# EasyEDA schematic ULN2003 Motor Driver_2021-05-13.json
TITLE: Sheet_1; REV: 1.0; Date: 2021-05-13; Sheet: 1/1; Drawn By: Sreeram AJ; Company: Your Company
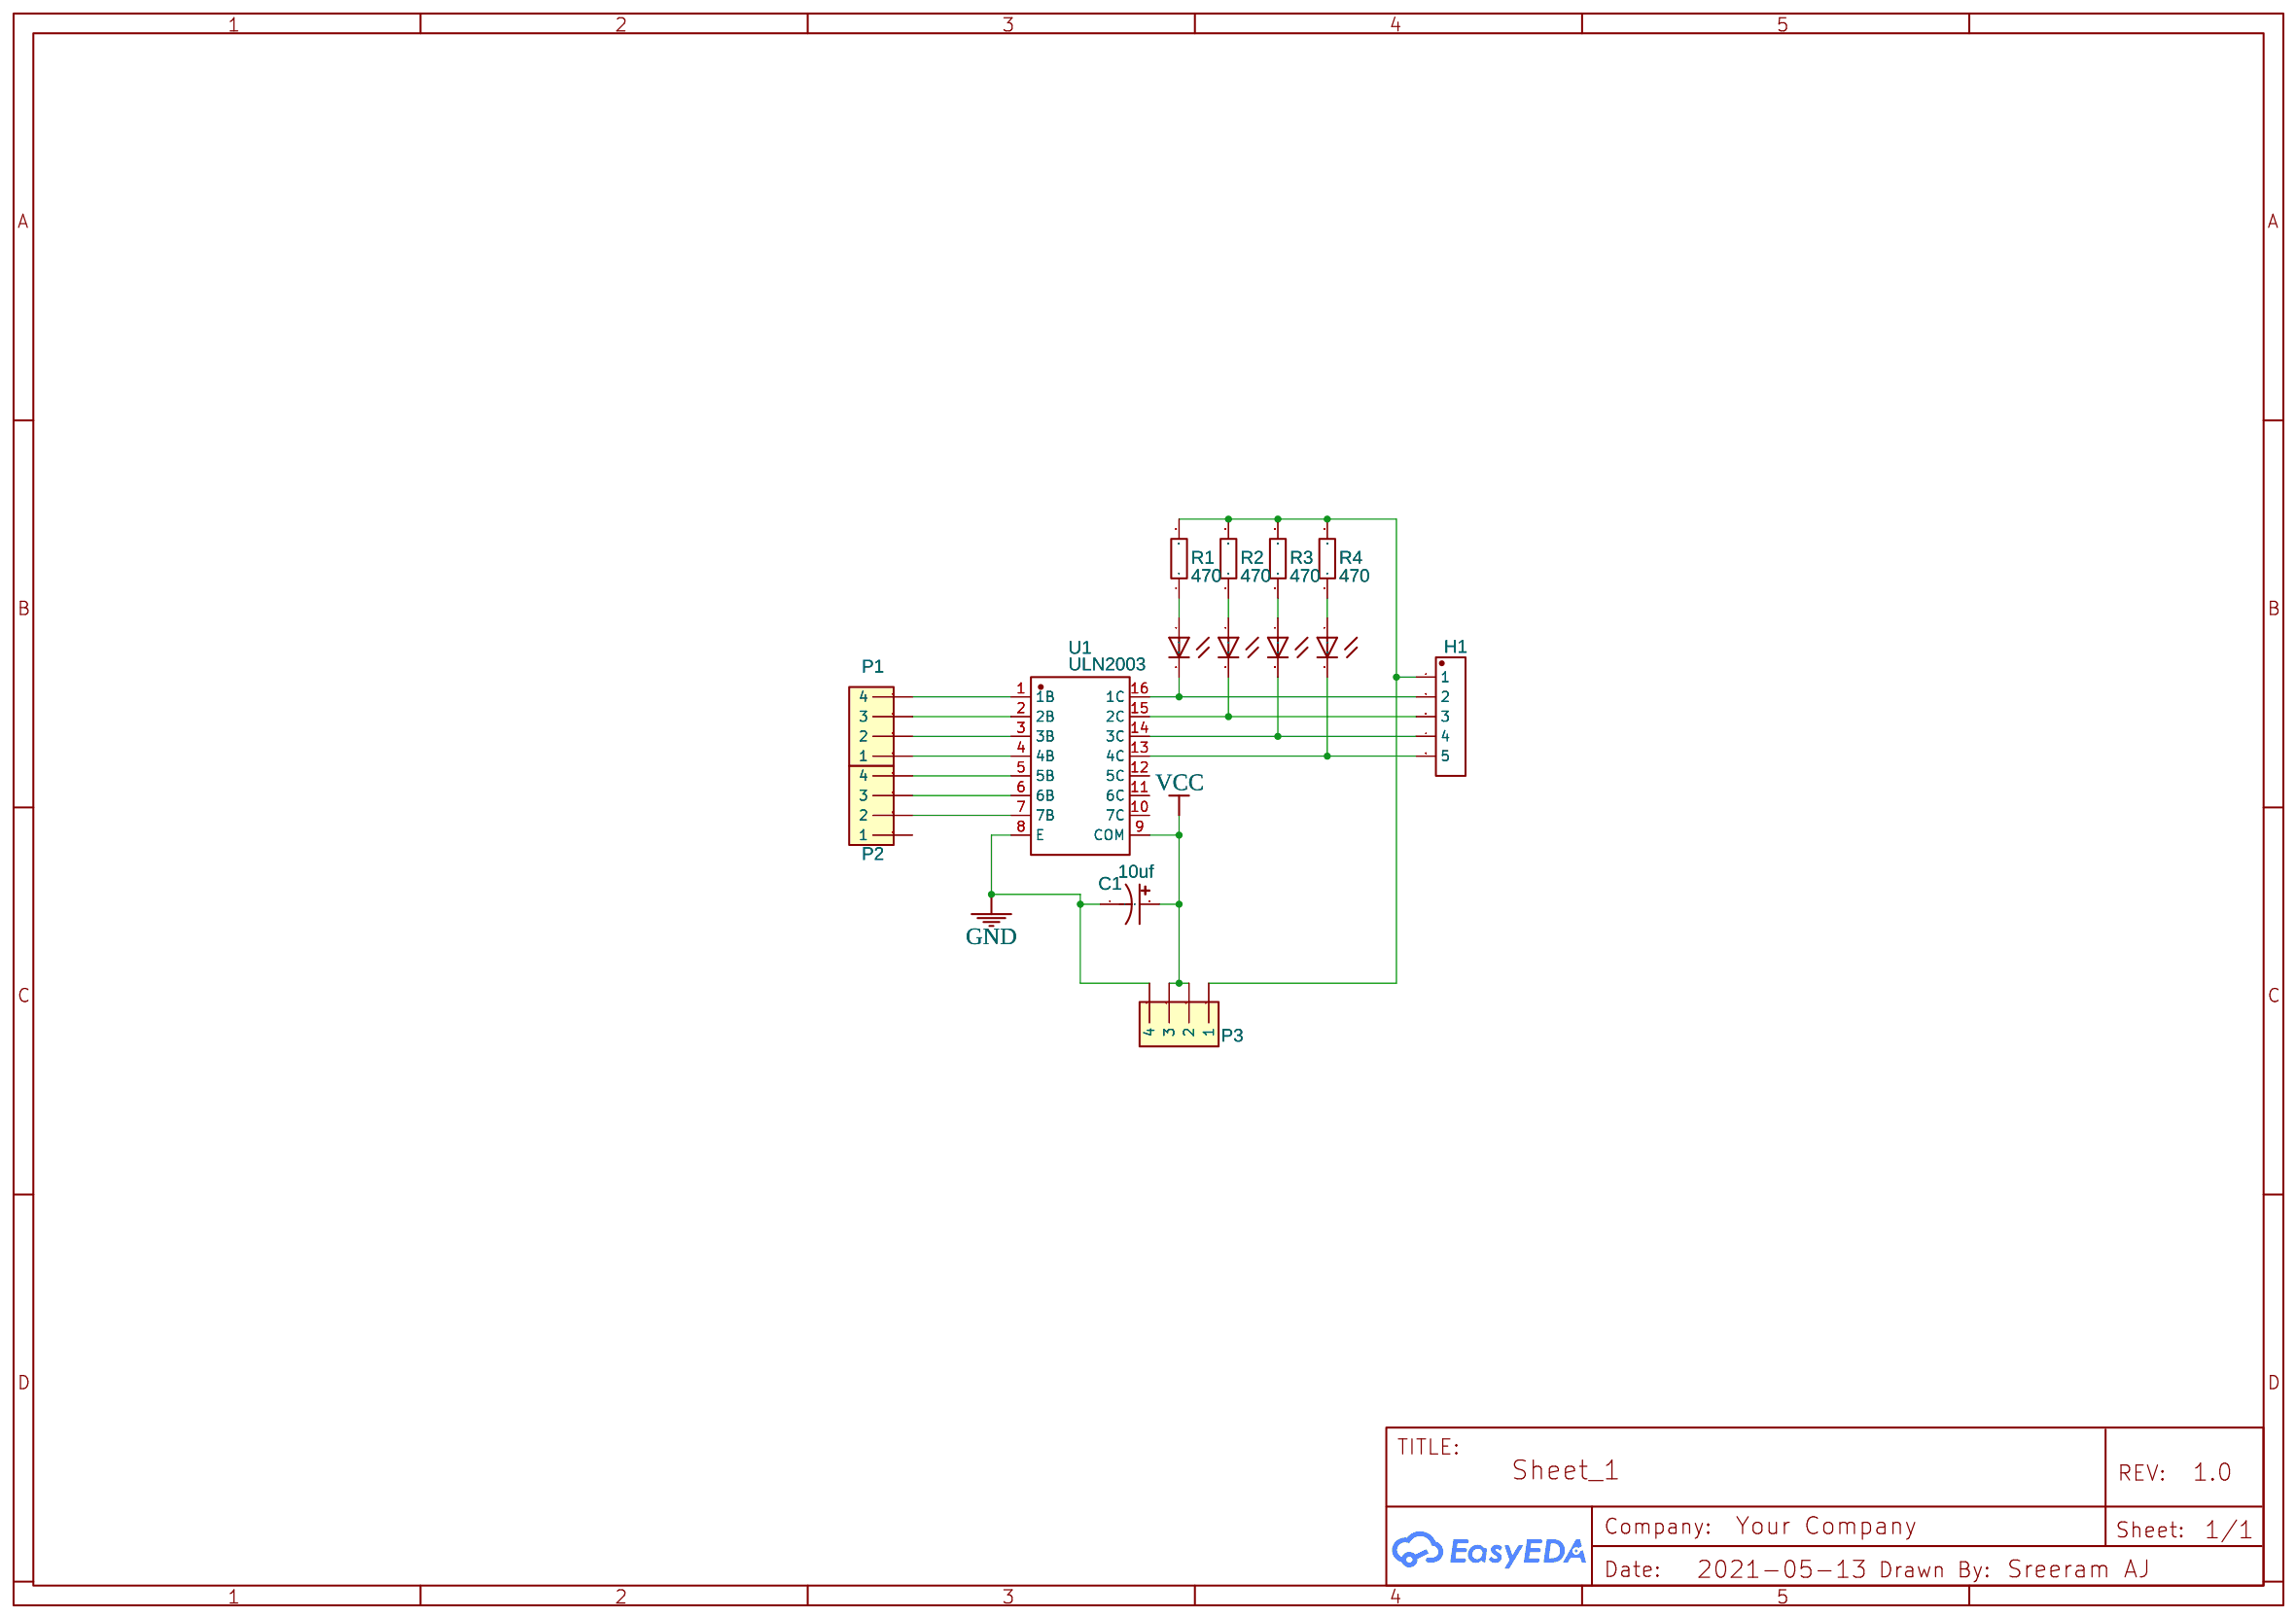
[diagram p0: schematic sheet]

## Parts
C1  10uf  [0603-POL]
H1  Male Header 1*5P  [MALE HEADER 5P]
LED1  LED - SMD - 0603  [LED - 0603]
LED2  LED - SMD - 0603  [LED - 0603]
LED3  LED - SMD - 0603  [LED - 0603]
LED4  LED - SMD - 0603  [LED - 0603]
P1  Male_header_bend_2.54mm_1*4P_copy  [1*4 PIN HEADER]
P2  Male_header_bend_2.54mm_1*4P_copy  [1*4 PIN HEADER]
P3  Male_header_bend_2.54mm_1*4P_copy  [1*4 PIN HEADER]
R1  470  [0603]
R2  470  [0603]
R3  470  [0603]
R4  470  [0603]
U1  ULN2003  [SOP-16_L9.9-W3.9-P1.27-LS6.1-BL]

## Library data of the parts
C1 = 10UF-6.3V-20%(0603)(TANT)
H1 = Male Header 1*5P: Manufacturer: Ckmtw; Manufacturer Part: 210S-1*5P L=11.6MMGold-plated black; Contributor: R1S8K LLTP; LCSC Assembly: Yes; SMT Type: Extend
LED1-LED4 = LED - SMD - 0603: LED; Contributor: corlovsky
P1-P3 = Male_header_bend_2.54mm_1*4P_copy: EasyEDA: C35167; Supplier Part: C35167; Supplier: EasyEDA; Contributor: souvick_saha
R1-R4 = 1k Resistor SMD 0603 (C73797): Supplier Part: C73797; Supplier: LCSC; Manufacturer: FH; Manufacturer Part: RS-03K102JT
U1 = ULN2003: Supplier: LCSC; Supplier Part: C2690547; Manufacturer: BL(上海贝岭); Contributor: LCSC

## Nets
GND: C1.K(-) P3.4 U1.8(E)
VCC: C1.A(+) P3.2 P3.3 U1.9(COM)
Net-(H1-1): H1.1 P3.1 R1.2 R2.2 R3.2 R4.2
Net-(H1-2): H1.2 LED1.2 U1.16(1C)
Net-(H1-3): H1.3 LED2.2 U1.15(2C)
Net-(H1-4): H1.4 LED3.2 U1.14(3C)
Net-(H1-5): H1.5 LED4.2 U1.13(4C)
Net-(LED1-1): LED1.1 R1.1
Net-(LED2-1): LED2.1 R2.1
Net-(LED3-1): LED3.1 R3.1
Net-(LED4-1): LED4.1 R4.1
Net-(P1-1): P1.1 U1.4(4B)
Net-(P1-2): P1.2 U1.3(3B)
Net-(P1-3): P1.3 U1.2(2B)
Net-(P1-4): P1.4 U1.1(1B)
Net-(P2-2): P2.2 U1.7(7B)
Net-(P2-3): P2.3 U1.6(6B)
Net-(P2-4): P2.4 U1.5(5B)

Not connected (* = marked no-connect by the designer): P2 1; U1 10(7C) 11(6C) 12(5C)
